# EAGLE design SatNOGSBoard (EAGLE 7.2.0)
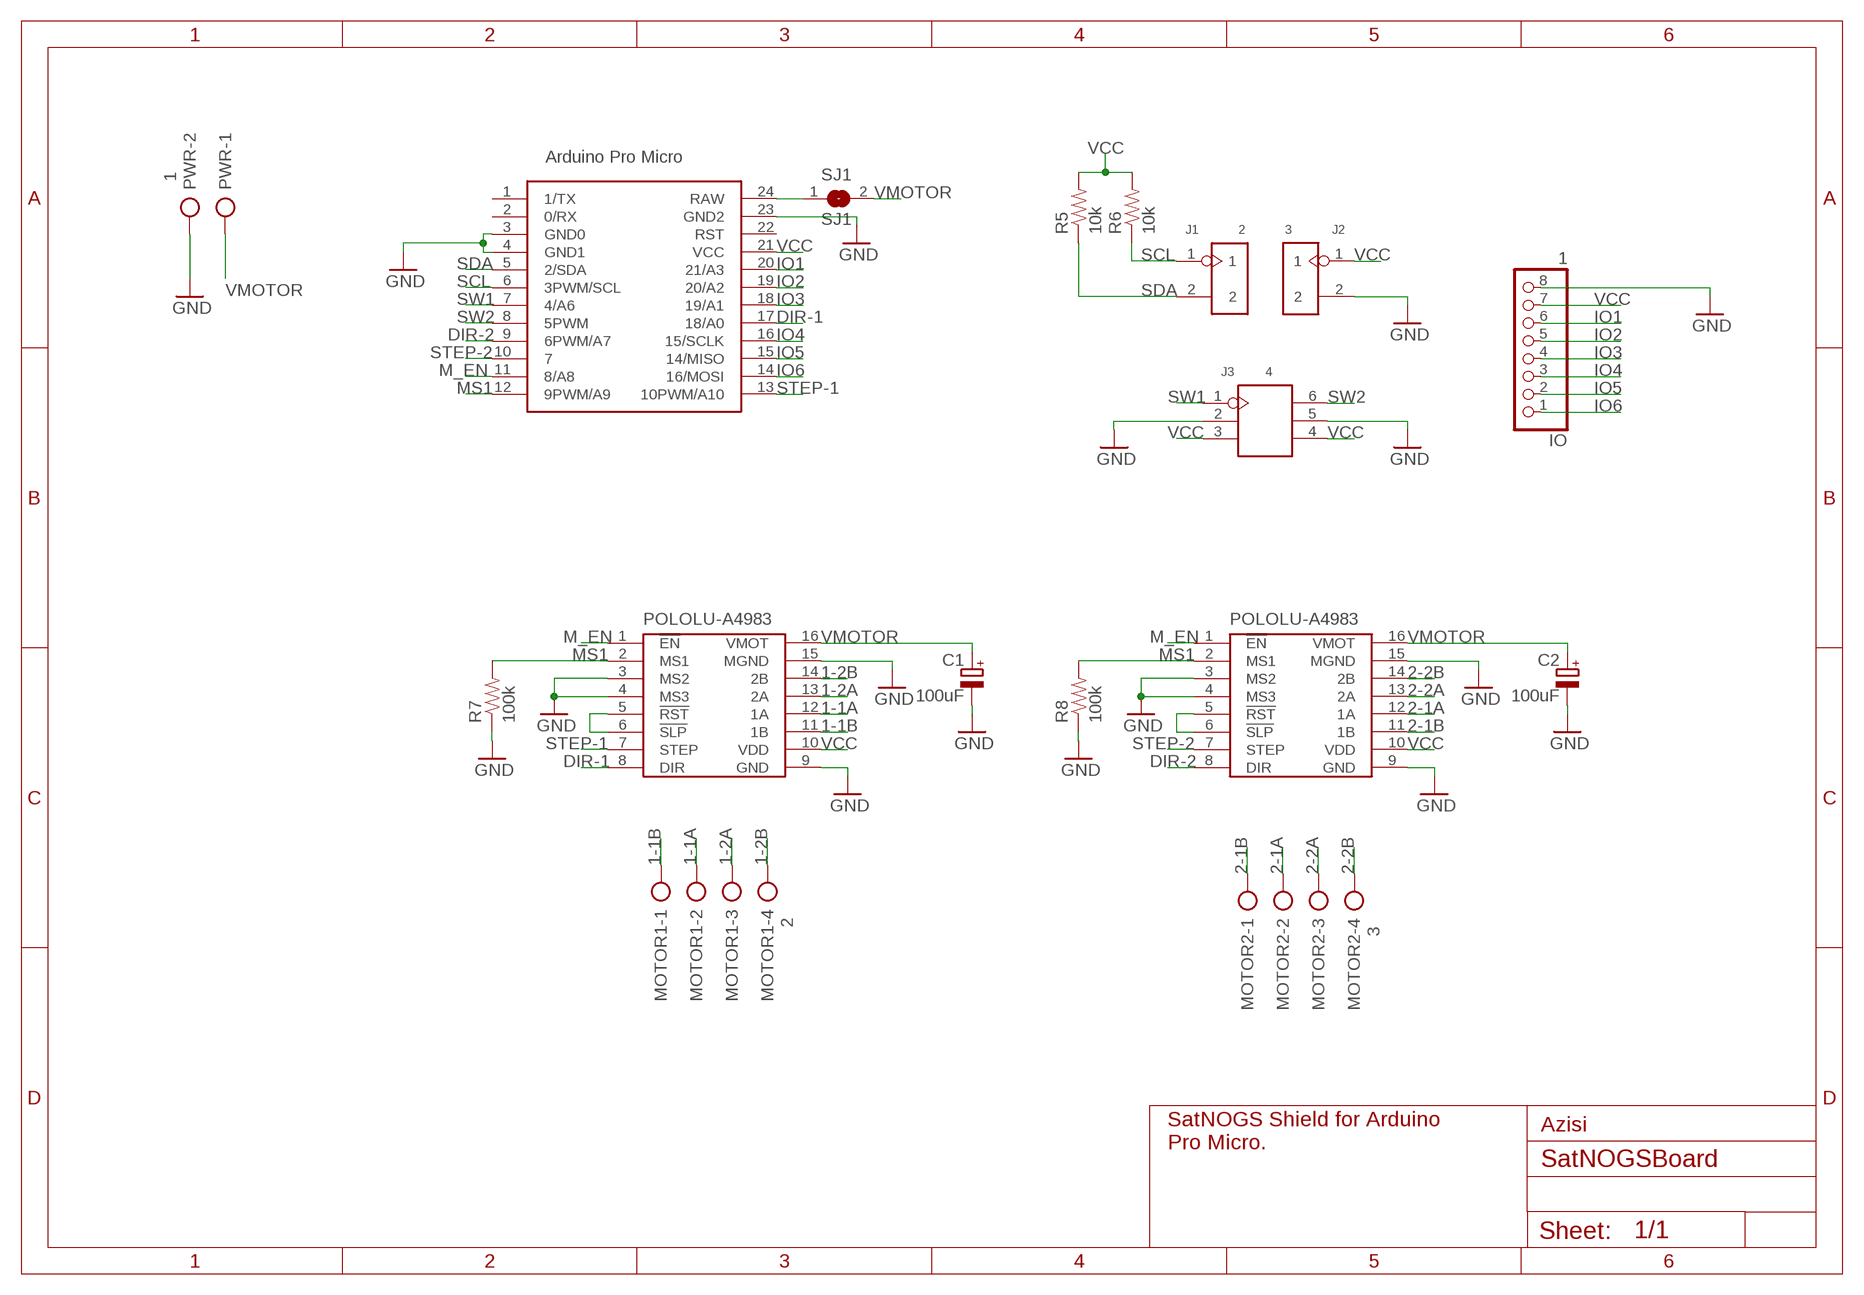
[diagram p0: schematic, sheet 1]

## Parts
AZIMUTH  POLOLU-A4983POLOLU-A4983  [POLOLU-A4983]
C1  100uF  CPOL-EUE2.5-6  [E2,5-6]
C2  100uF  CPOL-EUE2.5-6  [E2,5-6]
ELEVATION  POLOLU-A4983POLOLU-A4983  [POLOLU-A4983]
IO  1  PINHD-1X8  [1X08]
J1  2  HEADER-2P-65/35MIL  [2P-2.54-65/35MIL]
J2  3  HEADER-2P-65/35MIL  [2P-2.54-65/35MIL]
J3  4  HEADER-2X3P-2.54  [2X3P-2.54-65/35MIL]
MOTOR1  2  AK500/4  [AK500/4]
MOTOR2  3  AK500/4  [AK500/4]
PWR  1  AK500/2  [AK500/2]
R5  10k  RESISTORPTH-1/4W  [AXIAL-0.4]
R6  10k  RESISTORPTH-1/4W  [AXIAL-0.4]
R7  100k  RESISTORPTH-1/4W  [AXIAL-0.4]
R8  100k  RESISTORPTH-1/4W  [AXIAL-0.4]
SJ1  SJ1  SJW  [SJW]
UC  ARDUINO_PRO_MICROARDUINO_BOARD  [ARDUINO_MICRO_PRO]

## Nets
1-1A: AZIMUTH.12(1A) MOTOR1.2
1-1B: AZIMUTH.11(1B) MOTOR1.1
1-2A: AZIMUTH.13(2A) MOTOR1.3
1-2B: AZIMUTH.14(2B) MOTOR1.4
2-1A: ELEVATION.12(1A) MOTOR2.2
2-1B: ELEVATION.11(1B) MOTOR2.1
2-2A: ELEVATION.13(2A) MOTOR2.3
2-2B: ELEVATION.14(2B) MOTOR2.4
DIR-1: AZIMUTH.8(DIR) UC.17(18/A0)
DIR-2: ELEVATION.8(DIR) UC.9(6PWM/A7)
GND: AZIMUTH.3(MS2) AZIMUTH.4(MS3) AZIMUTH.9(GND) AZIMUTH.15(MGND) C1.- C2.- ELEVATION.3(MS2) ELEVATION.4(MS3) ELEVATION.9(GND) ELEVATION.15(MGND) IO.8 J2.2 J3.2 J3.5 PWR.2 R7.P$1 R8.P$1 UC.3(GND0) UC.4(GND1) UC.23(GND2)
IO1: IO.6 UC.20(21/A3)
IO2: IO.5 UC.19(20/A2)
IO3: IO.4 UC.18(19/A1)
IO4: IO.3 UC.16(15/SCLK)
IO5: IO.2 UC.15(14/MISO)
IO6: IO.1 UC.14(16/MOSI)
M_EN: AZIMUTH.1(!EN) ELEVATION.1(!EN) UC.11(8/A8)
MS1: AZIMUTH.2(MS1) ELEVATION.2(MS1) R7.P$2 R8.P$2 UC.12(9PWM/A9)
N$1: AZIMUTH.5(!RST) AZIMUTH.6(!SLP)
N$2: ELEVATION.5(!RST) ELEVATION.6(!SLP)
N$3: SJ1.1 UC.24(RAW)
SCL: J1.1 R6.P$1 UC.6(3PWM/SCL)
SDA: J1.2 R5.P$1 UC.5(2/SDA)
STEP-1: AZIMUTH.7(STEP) UC.13(10PWM/A10)
STEP-2: ELEVATION.7(STEP) UC.10
SW1: J3.1 UC.7(4/A6)
SW2: J3.6 UC.8(5PWM)
VCC: AZIMUTH.10(VDD) ELEVATION.10(VDD) IO.7 J2.1 J3.3 J3.4 R5.P$2 R6.P$2 UC.21(VCC)
VMOTOR: AZIMUTH.16(VMOT) C1.+ C2.+ ELEVATION.16(VMOT) PWR.1 SJ1.2
Unconnected: UC.1(1/TX) UC.2(0/RX) UC.22(RST)

## Notes on the sheet
- Azisi
- SatNOGS Shield for Arduino
  Pro Micro.

## Library data of the parts
AZIMUTH ELEVATION = Pololu-A4983:POLOLU-A4983
C1 C2 = rcl:CPOL-EU: POLARIZED CAPACITOR, European symbol
IO = pinhead:PINHD-1X8: PIN HEADER
J1 J2 = Connector:HEADER-2P
J3 = Connector:HEADER-2X3P
MOTOR1 MOTOR2 = con-ptr500:AK500/4: CONNECTOR; OC_FARNELL: unknown; OC_NEWARK: unknown
PWR = con-ptr500:AK500/2: CONNECTOR; OC_FARNELL: unknown; OC_NEWARK: unknown
R5-R8 = SparkFun-Resistors:RESISTOR: Resistor Basic schematic elements and footprints for 0603, 1206, and PTH resistors.
SJ1 = jumper:SJ: SMD solder JUMPER
UC = Arduino_Pro_Micro:ARDUINO_PRO_MICRO

## Board
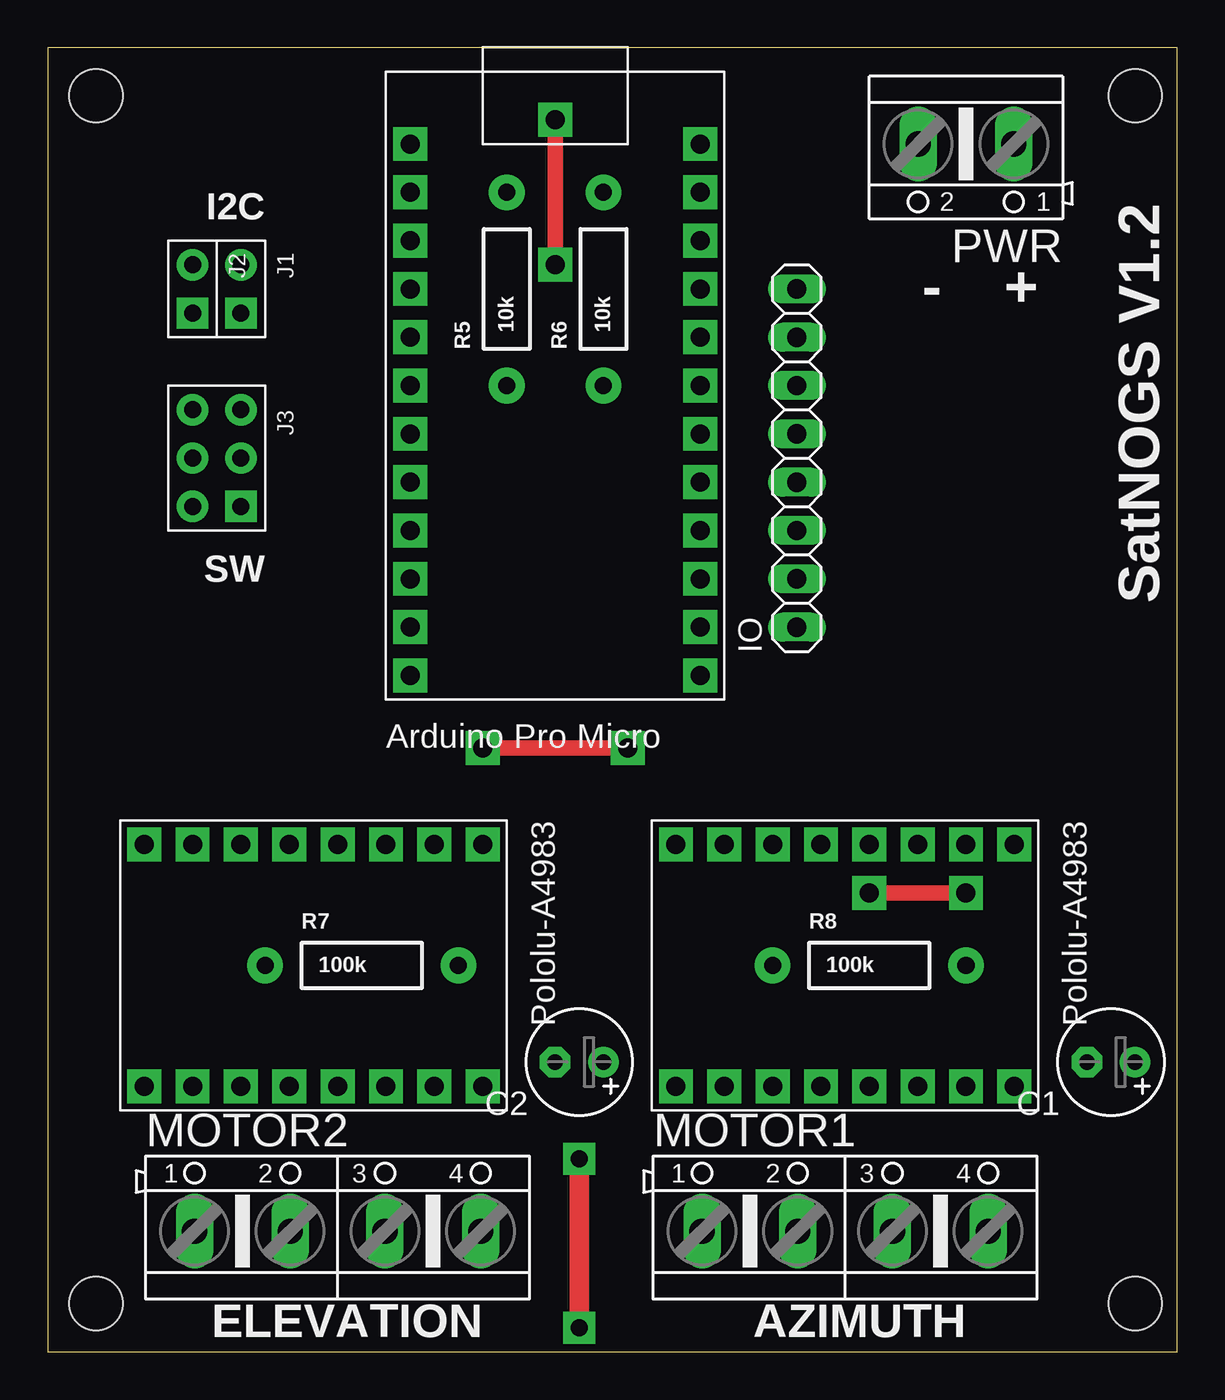
[diagram p1: board, top side]
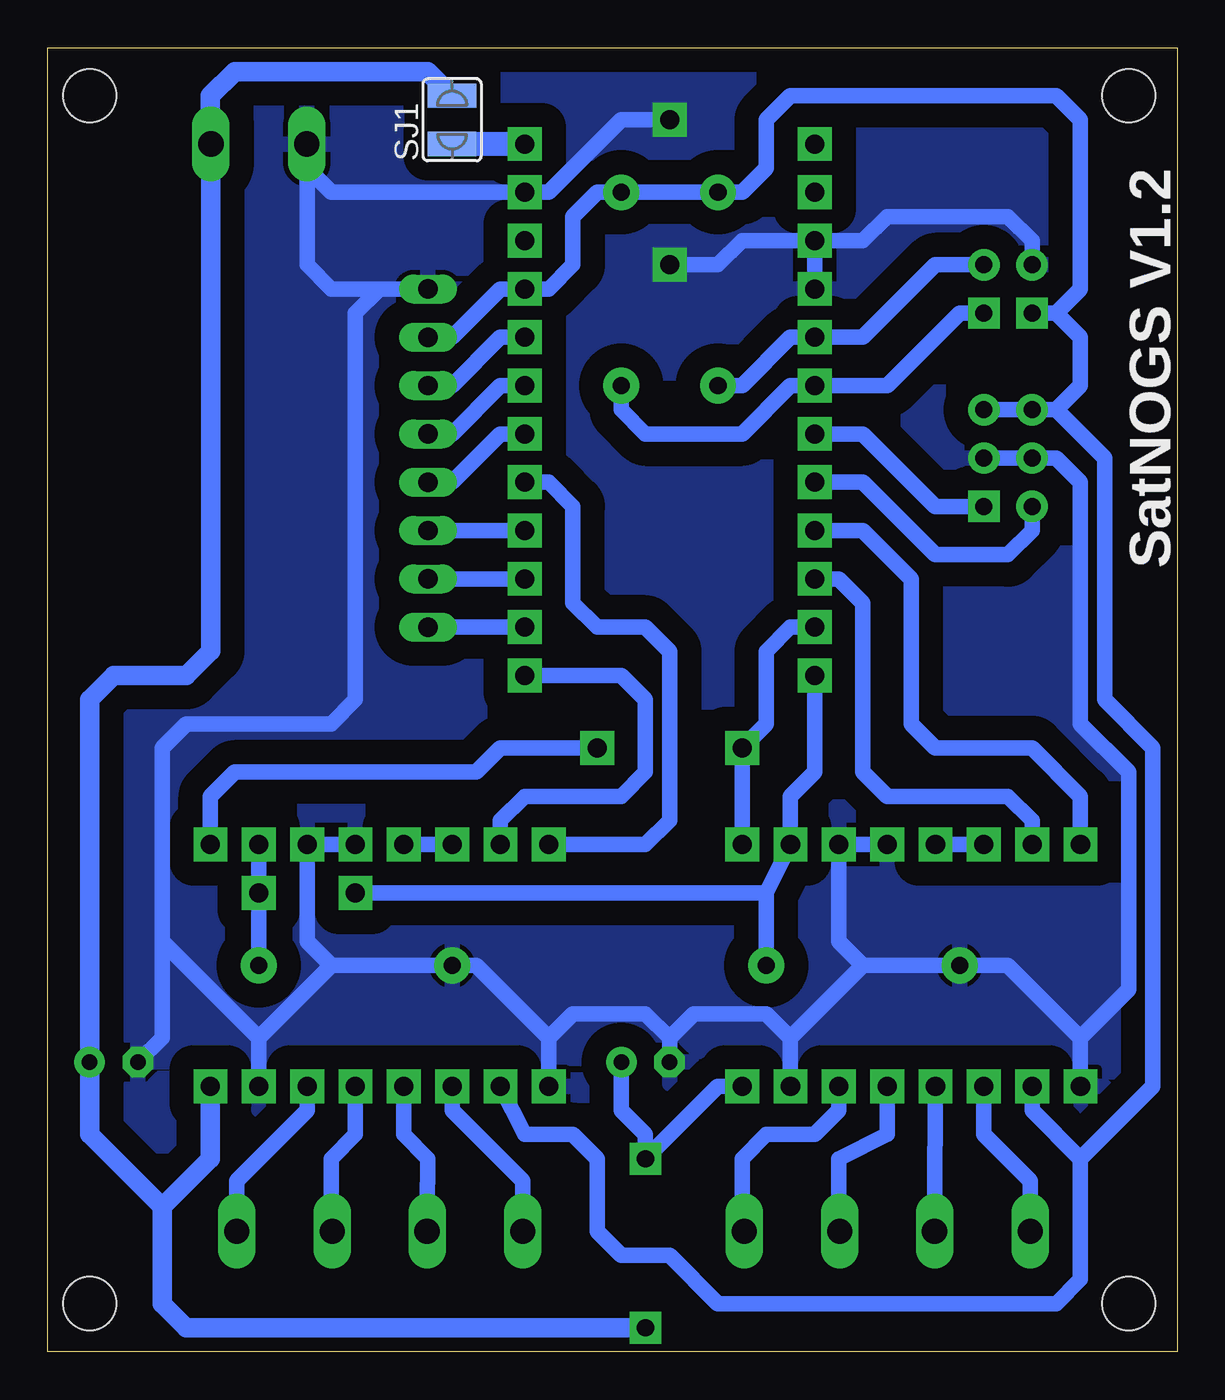
[diagram p2: board, bottom side, seen from below]

Size 59.36 x 68.57 mm. Coordinates in mm from the lower left corner, seen from the top.
Outline: 0,0 59.36,0 59.36,68.57 0,68.57 0,0
Copper layers (1*16): Top 0.035mm / dielectric 1.5mm / Bottom 0.035mm
Design rules "SeeedStudio_2layer_DRU_no_angle_20140221": minimum track width 6mil, minimum drill 12mil, track to track 6mil, track to pad 6mil, pad to pad 6mil, via to via 6mil, smd to smd 0mil, copper to edge 10mil, drill to drill 10mil, minimum pad ring 10mil, minimum via ring 6mil, stop-mask expansion 2mil, vias tented up to drill 100mil, thermal gap 10mil
Holes 2.8 mm at 2.54,66.04 57.15,66.04 2.54,2.54 57.15,2.54

### Footprints (pad centres in the part's own frame; a part is rotated, then mirrored left to right if it is on the bottom)
POLOLU-A4983 = drill 1 pad 1.778 square: 1 -6.35,8.89; 2 -6.35,6.35; 3 -6.35,3.81; 4 -6.35,1.27; 5 -6.35,-1.27; 6 -6.35,-3.81; 7 -6.35,-6.35; 8 -6.35,-8.89; 9 6.35,-8.89; 10 6.35,-6.35; 11 6.35,-3.81; 12 6.35,-1.27; 13 6.35,1.27; 14 6.35,3.81; 15 6.35,6.35; 16 6.35,8.89
E2,5-6 = drill 0.813 pad 1.6: + -1.27,0 | drill 0.813 pad 1.6 octagon: - 1.27,0
1X08 = drill 1.016 long: 1 -8.89,0; 2 -6.35,0; 3 -3.81,0; 4 -1.27,0; 5 1.27,0; 6 3.81,0; 7 6.35,0; 8 8.89,0
2P-2.54-65/35MIL = drill 0.889 pad 1.651 square: 1 0,1.27 | drill 0.889 pad 1.651: 2 0,-1.27
2X3P-2.54-65/35MIL = drill 0.889 pad 1.651 square: 1 -1.27,2.54 | drill 0.889 pad 1.651: 2 -1.27,0; 3 -1.27,-2.54; 4 1.27,-2.54; 5 1.27,0; 6 1.27,2.54
AK500/4 = drill 1.321 long: 1 -7.518,0; 2 -2.489,0; 3 2.489,0; 4 7.518,0
AK500/2 = drill 1.321 long: 1 -2.515,0; 2 2.515,0
AXIAL-0.4 = drill 0.9 pad 1.88: P$1 -5.08,0; P$2 5.08,0
SJW = smd 1.27 x 2.54: 1 -1.27,0; 2 1.27,0
ARDUINO_MICRO_PRO = drill 1 pad 1.778 square: 1 -7.62,12.7; 2 -7.62,10.16; 3 -7.62,7.62; 4 -7.62,5.08; 5 -7.62,2.54; 6 -7.62,0; 7 -7.62,-2.54; 8 -7.62,-5.08; 9 -7.62,-7.62; 10 -7.62,-10.16; 11 -7.62,-12.7; 12 -7.62,-15.24; 13 7.62,-15.24; 14 7.62,-12.7; 15 7.62,-10.16; 16 7.62,-7.62; 17 7.62,-5.08; 18 7.62,-2.54; 19 7.62,0; 20 7.62,2.54; 21 7.62,5.08; 22 7.62,7.62; 23 7.62,10.16; 24 7.62,12.7

### Placement (x,y rotation side)
AZIMUTH  41.91,20.32 270 top
C1  55.88,15.24 180 top
C2  27.94,15.24 180 top
ELEVATION  13.97,20.32 270 top
IO  39.37,46.99 90 top
J1  10.16,55.88 180 top
J2  7.62,55.88 180 top
J3  8.89,46.99 180 top
MOTOR1  41.91,6.35 0 top
MOTOR2  15.24,6.35 0 top
PWR  48.26,63.5 180 top
R5  24.13,55.88 90 top
R6  29.21,55.88 90 top
R7  16.51,20.32 0 top
R8  43.18,20.32 0 top
SJ1  38.1,64.77 90 bottom
UC  26.67,50.8 0 top

### Tracks (layer width: path | path; a pad name or v marks a point on that pad's centre or on a via)
1-1A
  Bottom 0.813: MOTOR1.2 39.42,8.84 39.37,8.89 39.37,10.16 40.64,11.43 AZIMUTH.12
1-1B
  Bottom 0.813: MOTOR1.1 34.39,8.99 38.1,12.7 AZIMUTH.11
1-2A
  Bottom 0.813: AZIMUTH.13 43.18,11.43 44.45,10.16 44.45,6.4 MOTOR1.3
1-2B
  Bottom 0.813: MOTOR1.4 49.43,8.99 45.72,12.7 AZIMUTH.14
2-1A
  Bottom 0.813: MOTOR2.2 12.75,10.21 12.7,11.43 ELEVATION.12
2-1B
  Bottom 0.813: MOTOR2.1 7.72,8.99 10.16,11.43 ELEVATION.11
2-2A
  Bottom 0.813: ELEVATION.13 15.24,11.43 17.78,10.16 17.78,6.4 MOTOR2.3
2-2B
  Bottom 0.813: MOTOR2.4 22.86,6.45 22.86,10.16 21.59,11.43 19.05,11.43 17.78,12.7 ELEVATION.14
DIR-1
  Bottom 0.813: AZIMUTH.8 27.94,26.67 26.67,27.94 26.67,36.83 27.94,38.1 30.48,38.1 31.75,39.37 31.75,44.45 33.02,45.72 UC.17
DIR-2
  Bottom 0.813: ELEVATION.8 5.08,29.21 7.62,31.75 12.7,31.75 13.97,33.02 13.97,40.64 16.51,43.18 UC.9
GND  (via drill 1 pad 1.78)
  Top 0.813: v26.67,64.77 v26.67,57.15
  Bottom 0.813: UC.4 UC.3 | ELEVATION.4 ELEVATION.3 17.78,21.59 16.51,20.32 | AZIMUTH.4 AZIMUTH.3 45.72,21.59 44.45,20.32 | ELEVATION.9 5.08,16.51 | 16.51,20.32 R7.P$1 8.89,20.32 5.08,16.51 | ELEVATION.15 20.32,16.51 | 33.02,16.51 31.75,17.78 27.94,17.78 26.67,16.51 | 33.02,16.51 AZIMUTH.9 | 48.26,16.51 AZIMUTH.15 | 44.45,20.32 R8.P$1 36.83,20.32 33.02,16.51 | 44.45,20.32 48.26,16.51 | 48.26,16.51 53.34,21.59 | 53.34,21.59 53.34,31.75 52.07,33.02 44.45,33.02 43.18,34.29 43.18,54.61 41.91,55.88 | UC.3 22.86,58.42 24.13,57.15 v26.67,57.15 | 20.32,16.51 16.51,20.32 | v26.67,64.77 29.21,64.77 33.02,60.96 UC.23 44.45,60.96 45.72,62.23 | 5.08,16.51 2.54,19.05 2.54,30.48 5.08,33.02 5.08,45.72 6.35,46.99 J3.5 J3.2 | UC.3 16.51,58.42 15.24,59.69 8.89,59.69 7.62,58.42 J2.2 | 53.34,21.59 53.34,16.51 C1.- | 26.67,16.51 25.4,17.78 21.59,17.78 20.32,16.51 | 26.67,16.51 C2.- | 41.91,55.88 IO.8 | 41.91,55.88 44.45,55.88 45.72,57.15 45.72,62.23 | 45.72,62.23 45.72,63.48 PWR.2
  pour Bottom (isolate 1.27): 0,68.58 0,0 59.69,0 59.69,68.58
IO1
  Bottom 0.813: UC.20 35.56,53.34 38.1,50.8 IO.6
IO2
  Bottom 0.813: UC.19 35.56,50.8 38.1,48.26 IO.5
IO3
  Bottom 0.813: UC.18 35.56,48.26 38.1,45.72 IO.4
IO4
  Bottom 0.813: UC.16 IO.3
IO5
  Bottom 0.813: UC.15 IO.2
IO6
  Bottom 0.813: UC.14 IO.1
M_EN  (via drill 1 pad 1.78)
  Top 0.813: v30.48,31.75 v22.86,31.75
  Bottom 0.813: ELEVATION.1 v22.86,31.75 21.59,33.02 21.59,36.83 20.32,38.1 UC.11 | AZIMUTH.1 50.8,29.21 49.53,30.48 36.83,30.48 35.56,31.75 v30.48,31.75
MS1  (via drill 1 pad 1.78)
  Top 0.813: v43.18,24.13 v48.26,24.13
  Bottom 0.813: UC.12 19.05,30.48 20.32,29.21 ELEVATION.2 21.59,24.13 | R8.P$2 v48.26,24.13 AZIMUTH.2 | R7.P$2 21.59,24.13 | v43.18,24.13 21.59,24.13
N$1
  Bottom 0.813: AZIMUTH.6 AZIMUTH.5
N$2
  Bottom 0.813: ELEVATION.6 ELEVATION.5
N$3
  Bottom 1.27: UC.24 SJ1.1
SCL
  Bottom 0.813: R6.P$1 29.21,49.53 27.94,48.26 22.86,48.26 20.32,50.8 UC.6 15.24,50.8 11.43,54.61 J1.1
SDA
  Bottom 0.813: R5.P$1 22.86,50.8 20.32,53.34 UC.5 16.51,53.34 12.7,57.15 J1.2
STEP-1
  Bottom 0.813: AZIMUTH.7 35.56,27.94 34.29,29.21 29.21,29.21 27.94,30.48 27.94,34.29 29.21,35.56 UC.13
STEP-2
  Bottom 0.813: UC.10 17.78,40.64 16.51,39.37 16.51,30.48 15.24,29.21 8.89,29.21 7.62,27.94 ELEVATION.7
SW1
  Bottom 0.813: J3.1 12.7,44.45 16.51,48.26 UC.7
SW2
  Bottom 0.813: J3.6 7.62,43.18 8.89,41.91 12.7,41.91 16.51,45.72 UC.8
VCC
  Bottom 0.813: AZIMUTH.10 34.29,11.43 31.75,11.43 30.48,10.16 30.48,6.35 29.21,5.08 26.67,5.08 24.13,2.54 6.35,2.54 5.08,3.81 5.08,10.16 | IO.7 38.1,53.34 35.56,55.88 UC.21 33.02,55.88 31.75,57.15 31.75,59.69 30.48,60.96 R6.P$2 R5.P$2 22.86,60.96 21.59,62.23 21.59,64.77 20.32,66.04 6.35,66.04 5.08,64.77 5.08,55.88 6.35,54.61 | 5.08,10.16 1.27,13.97 1.27,31.75 3.81,34.29 3.81,46.99 6.35,49.53 | 5.08,10.16 7.62,12.7 ELEVATION.10 | J2.1 6.35,54.61 | 6.35,54.61 5.08,53.34 5.08,50.8 6.35,49.53 | 6.35,49.53 J3.4 J3.3
VMOTOR  (via drill 0.9 pad 1.68)
  Top 1.016: v27.94,10.16 v27.94,1.27
  Bottom 0.813: C2.+ 29.21,12.7 27.94,11.43 v27.94,10.16 24.13,13.97 ELEVATION.16
  Bottom 1.016: v27.94,1.27 52.07,1.27 53.34,2.54 53.34,7.62 | 53.34,7.62 57.15,11.43 C1.+ 57.15,34.29 55.88,35.56 52.07,35.56 50.77,36.85 PWR.1 50.8,63.52 50.8,66.04 49.53,67.31 39.37,67.31 SJ1.2 | AZIMUTH.16 50.8,10.16 53.34,7.62

### Text on the board
tPlace: I2C | - | + | SW | SatNOGS V1.2 | ELEVATION | AZIMUTH
bPlace: SatNOGS V1.2